# EAGLE design Center Dash (EAGLE 9.6.2)
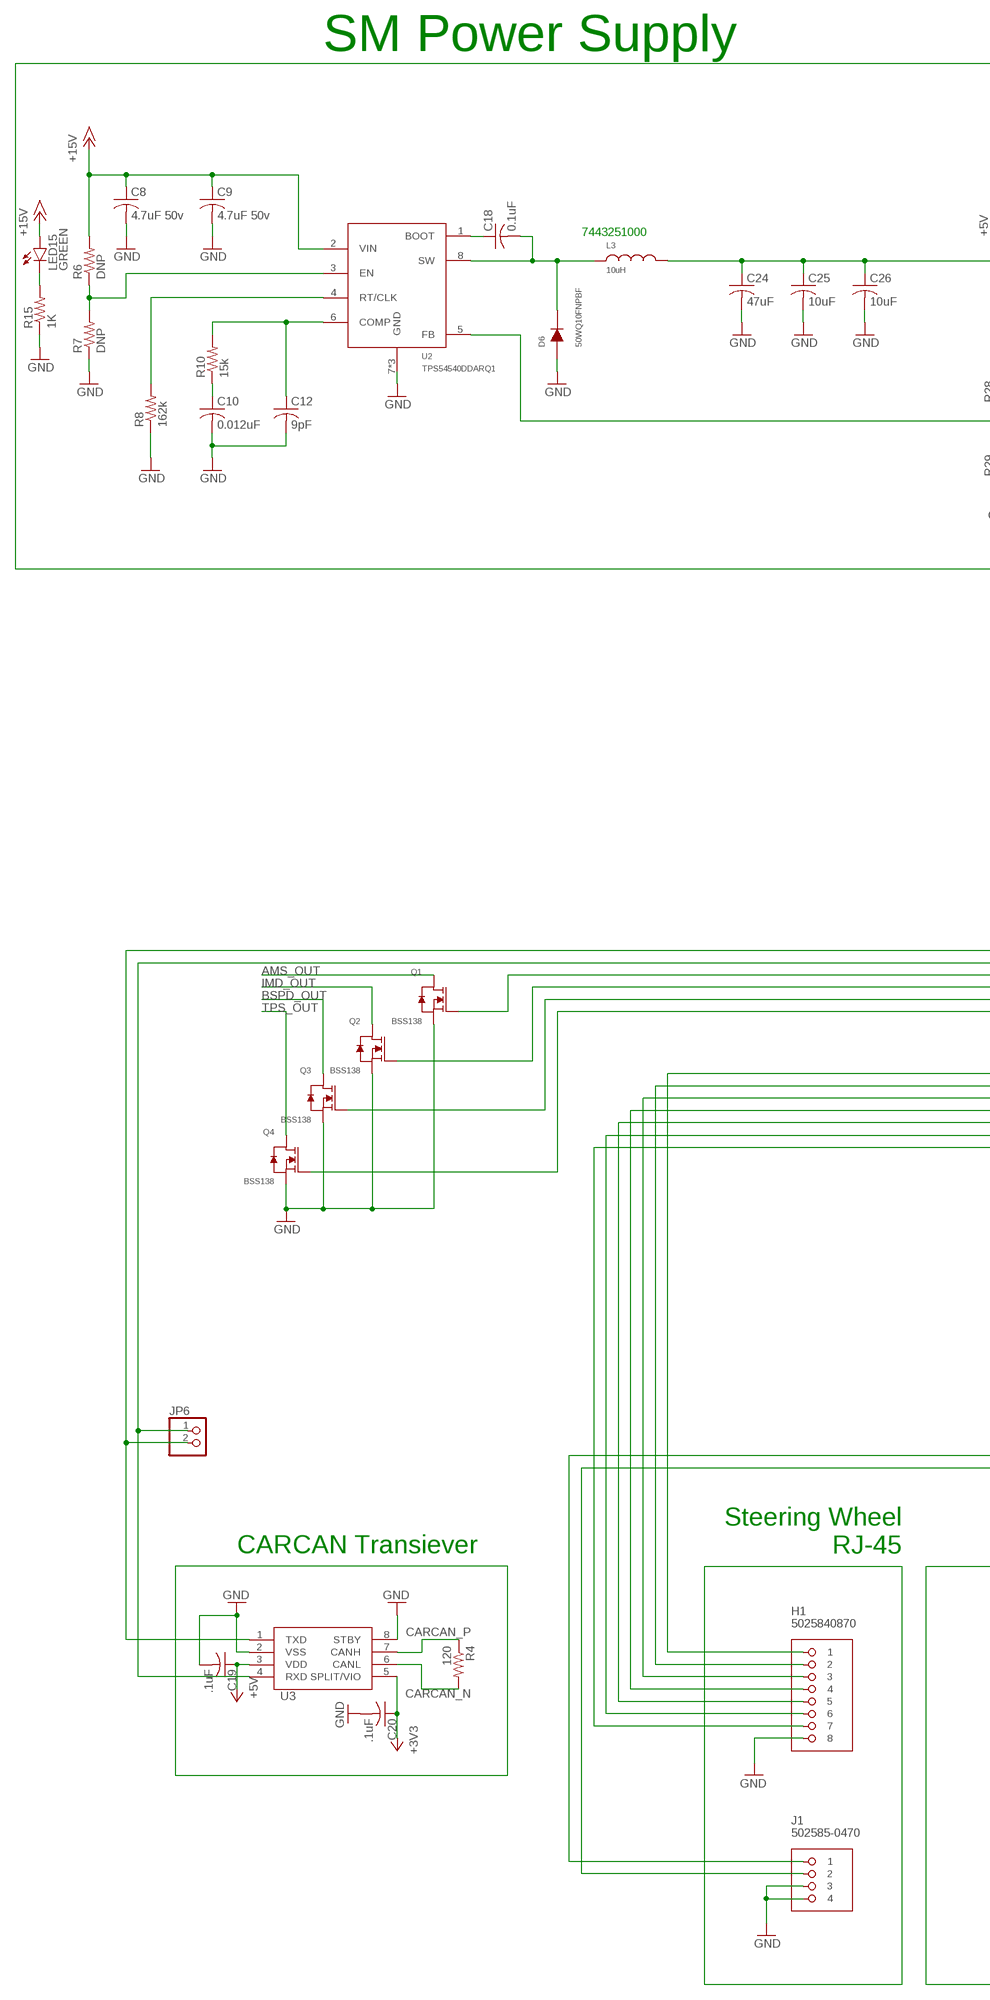
[diagram p0: schematic, sheet 1, part 1 of 2]
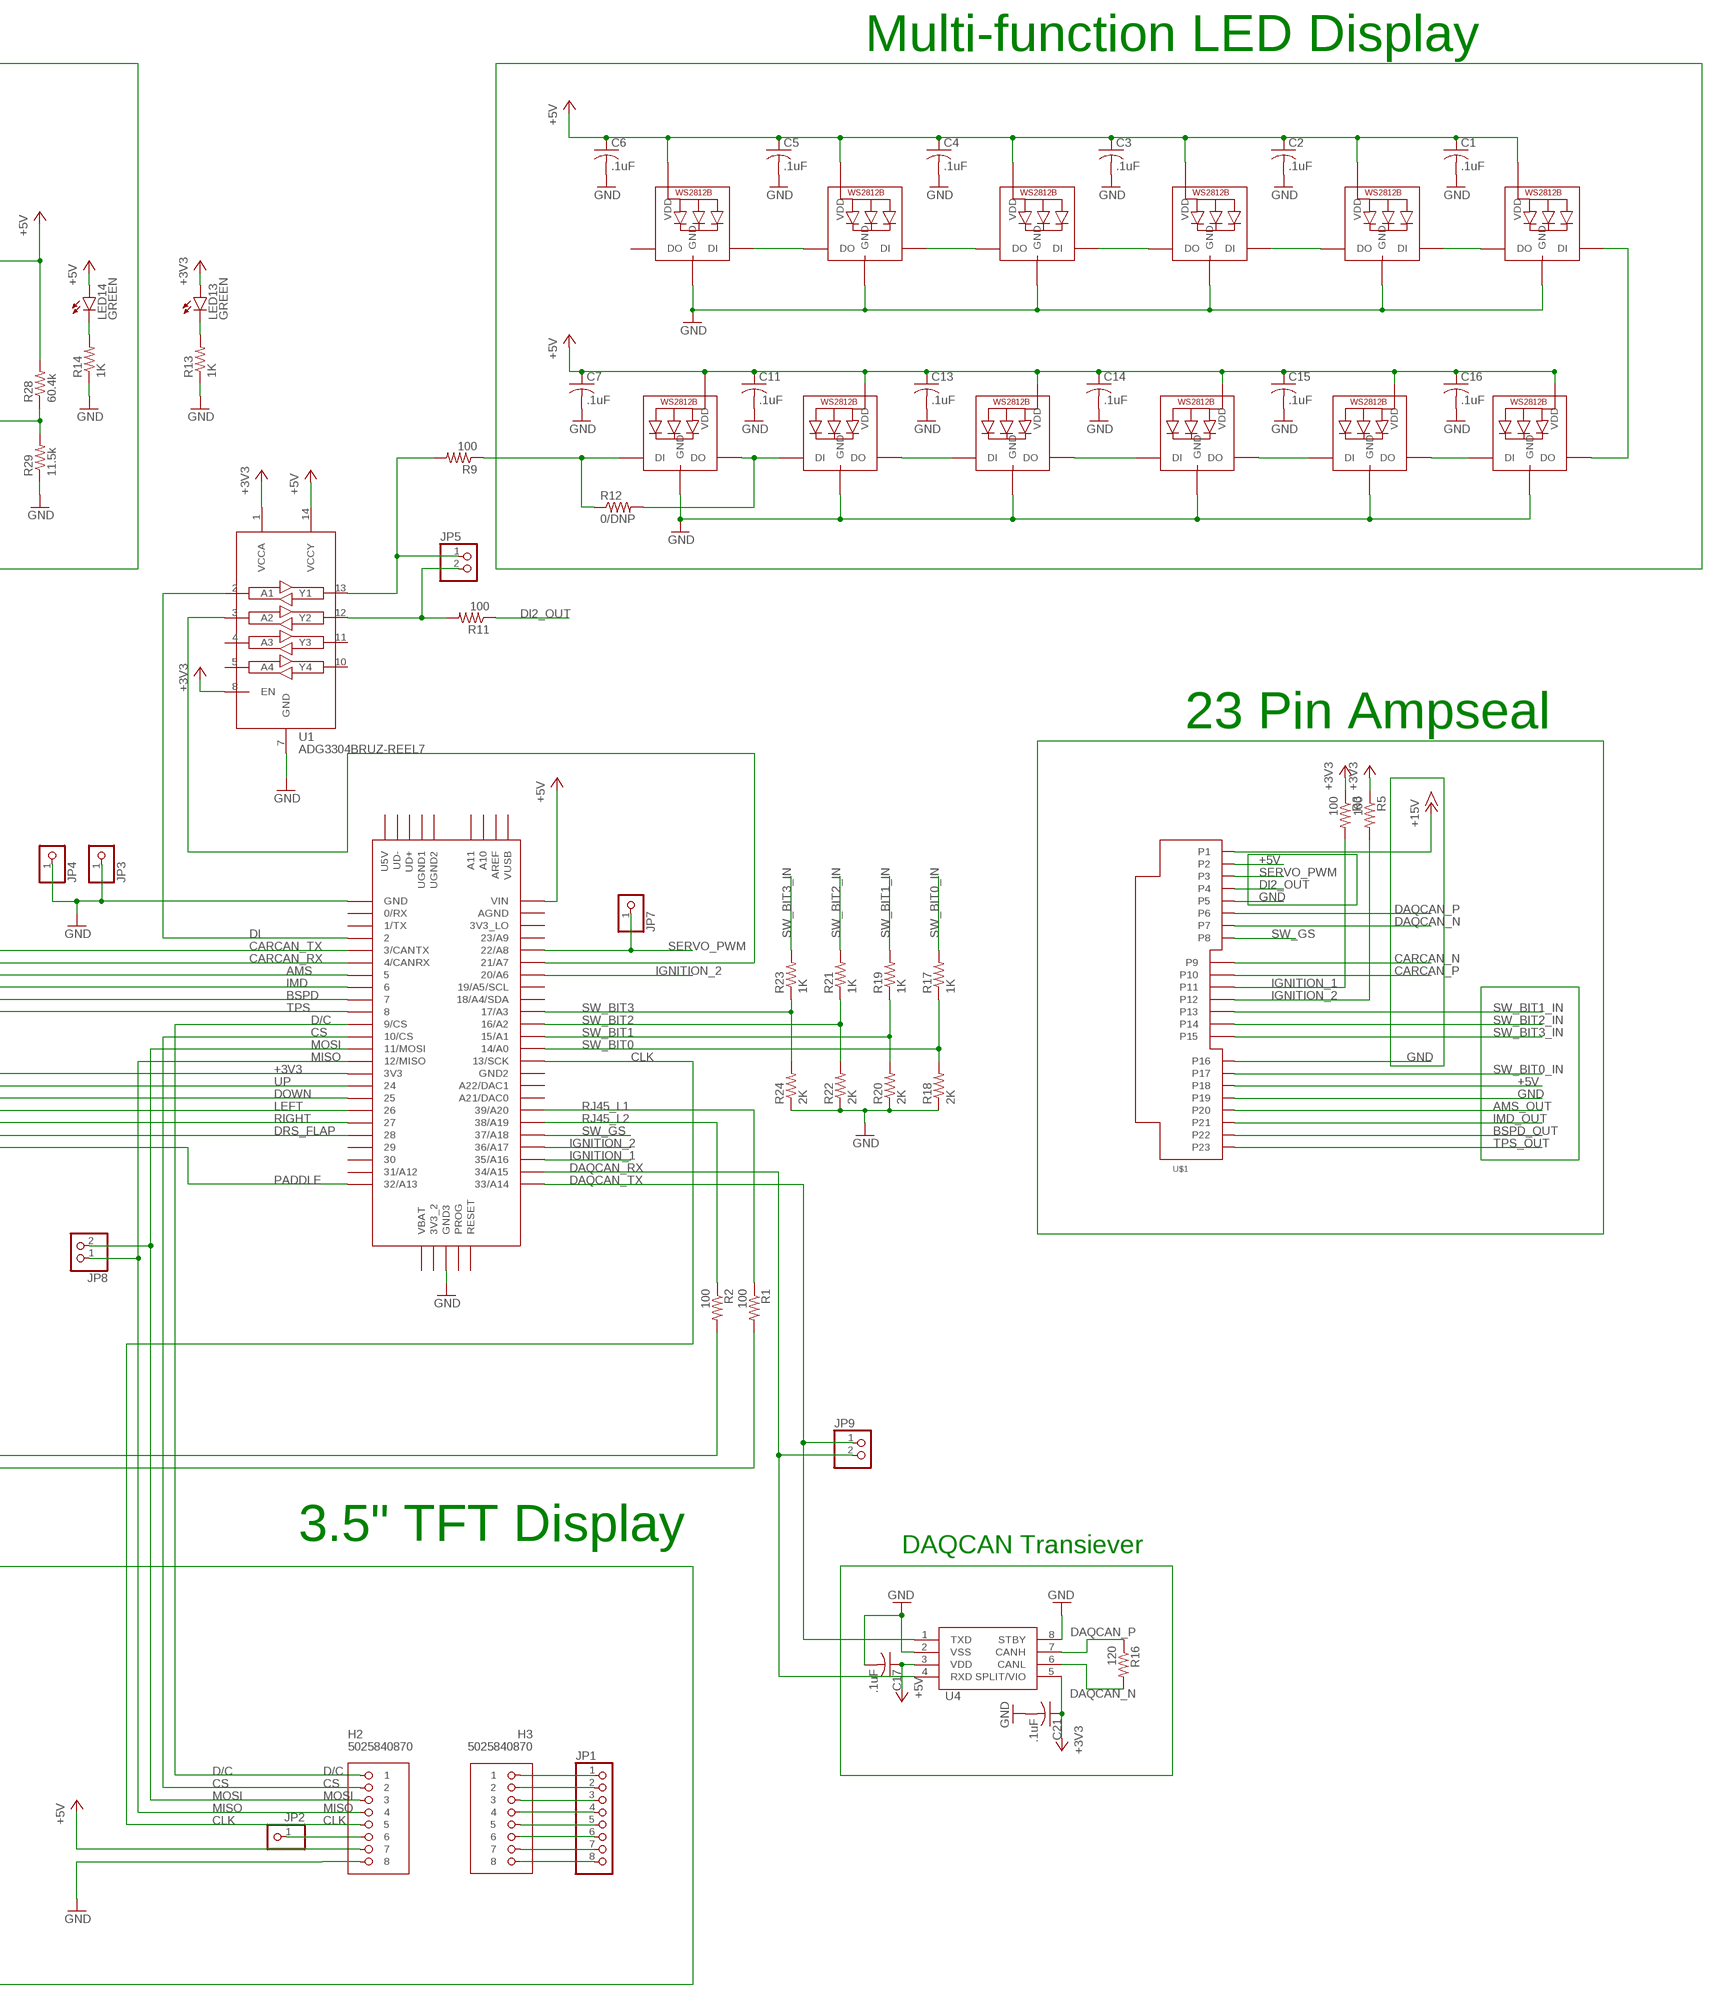
[diagram p1: schematic, sheet 1, part 2 of 2]

## Parts
C1  .1uF  C-USC0603K  [C0603K]
C2  .1uF  C-USC0603K  [C0603K]
C3  .1uF  C-USC0603K  [C0603K]
C4  .1uF  C-USC0603K  [C0603K]
C5  .1uF  C-USC0603K  [C0603K]
C6  .1uF  C-USC0603K  [C0603K]
C7  .1uF  C-USC0603K  [C0603K]
C8  4.7uF 50v  C-USC1206  [C1206]
C9  4.7uF 50v  C-USC1206  [C1206]
C10  0.012uF  C-USC0603K  [C0603K]
C11  .1uF  C-USC0603K  [C0603K]
C12  9pF  C-USC0603K  [C0603K]
C13  .1uF  C-USC0603K  [C0603K]
C14  .1uF  C-USC0603K  [C0603K]
C15  .1uF  C-USC0603K  [C0603K]
C16  .1uF  C-USC0603K  [C0603K]
C17  .1uF  C-USC0805  [C0805]
C18  0.1uF  C-USC0603K  [C0603K]
C19  .1uF  C-USC0805  [C0805]
C20  .1uF  C-USC0805  [C0805]
C21  .1uF  C-USC0805  [C0805]
C24  47uF  C-USC1206  [C1206]
C25  10uF  C-USC0603K  [C0603K]
C26  10uF  C-USC0603K  [C0603K]
D6  50WQ10FNPBF  VISHAY-50WQ10FNPBF  [DPAK]
H1  5025840870  MOLEX_CLICKMATE-8-VERTICAL  [MOLEX-CLIKMATE-8-VERTICAL-HEADER]
H2  5025840870  MOLEX_CLICKMATE-8-VERTICAL  [MOLEX-CLIKMATE-8-VERTICAL-HEADER]
H3  5025840870  MOLEX_CLICKMATE-8-VERTICAL  [MOLEX-CLIKMATE-8-VERTICAL-HEADER]
J1  502585-0470  MOLEX_CLICKMATE-4-R/A  [MOLEX-CLIKMATE-4-R/A]
JP1  PINHD-1X8  [1X08]
JP2  PINHD-1X1  [1X01]
JP3  PINHD-1X1  [1X01]
JP4  PINHD-1X1  [1X01]
JP5  PINHD-1X2  [1X02]
JP6  PINHD-1X2  [1X02]
JP7  PINHD-1X1  [1X01]
JP8  PINHD-1X2  [1X02]
JP9  PINHD-1X2  [1X02]
L3  10uH  WURTH-744325XXXX  [WURTH-744325XXXX]
LED1  WS2812B5050  [WS2812B]
LED2  WS2812B5050  [WS2812B]
LED3  WS2812B5050  [WS2812B]
LED4  WS2812B5050  [WS2812B]
LED5  WS2812B5050  [WS2812B]
LED6  WS2812B5050  [WS2812B]
LED7  WS2812B5050  [WS2812B]
LED8  WS2812B5050  [WS2812B]
LED9  WS2812B5050  [WS2812B]
LED10  WS2812B5050  [WS2812B]
LED11  WS2812B5050  [WS2812B]
LED12  WS2812B5050  [WS2812B]
LED13  GREEN  LEDCHIP-LED0805  [CHIP-LED0805]
LED14  GREEN  LEDCHIP-LED0805  [CHIP-LED0805]
LED15  GREEN  LEDCHIP-LED0805  [CHIP-LED0805]
Q1  BSS138  [BSS138]
Q2  BSS138  [BSS138]
Q3  BSS138  [BSS138]
Q4  BSS138  [BSS138]
R1  100  R-US_R0805  [R0805]
R2  100  R-US_R0805  [R0805]
R3  100  R-US_R0805  [R0805]
R4  120  R-US_R0805  [R0805]
R5  100  R-US_R0805  [R0805]
R6  DNP  R-US_R0603  [R0603]
R7  DNP  R-US_R0603  [R0603]
R8  162k  R-US_R0603  [R0603]
R9  100  R-US_R0805  [R0805]
R10  15k  R-US_R0603  [R0603]
R11  100  R-US_R0805  [R0805]
R12  0/DNP  R-US_R0805  [R0805]
R13  1K  R-US_R0805  [R0805]
R14  1K  R-US_R0805  [R0805]
R15  1K  R-US_R0805  [R0805]
R16  120  R-US_R0805  [R0805]
R17  1K  R-US_R0805  [R0805]
R18  2K  R-US_R0805  [R0805]
R19  1K  R-US_R0805  [R0805]
R20  2K  R-US_R0805  [R0805]
R21  1K  R-US_R0805  [R0805]
R22  2K  R-US_R0805  [R0805]
R23  1K  R-US_R0805  [R0805]
R24  2K  R-US_R0805  [R0805]
R28  60.4k  R-US_R0603  [R0603]
R29  11.5k  R-US_R0603  [R0603]
U1  ADG3304BRUZ-REEL7  ADG3304  [ADG3304]
U2  TPS54540DDARQ1  TPS54540  [TPS54540]
U3  MCP256X-SOIC  [SOIC8-N_MC]
U4  MCP256X-SOIC  [SOIC8-N_MC]
U$1  TE-776200-1  [TE-776200-1]
U$2  TEENSY_3.5/3.6  [TEENSY_3.5/3.6]

## Nets
5VREG_EN: R6.1 R7.2 U2.3(EN)
+3V3: C20.1 C21.1 H1.1 LED13.A R3.1 R5.1 U1.1(VCCA) U1.8(EN) U3.5(SPLIT/VIO) U4.5(SPLIT/VIO) U$2.3V3
+5V: C1.1 C2.1 C3.1 C4.1 C5.1 C6.1 C7.1 C11.1 C13.1 C14.1 C15.1 C16.1 C17.1 C19.1 C24.1 C25.1 C26.1 H2.7 L3.P$2 LED1.1-VDD(VDD) LED2.1-VDD(VDD) LED3.1-VDD(VDD) LED4.1-VDD(VDD) LED5.1-VDD(VDD) LED6.1-VDD(VDD) LED7.1-VDD(VDD) LED8.1-VDD(VDD) LED9.1-VDD(VDD) LED10.1-VDD(VDD) LED11.1-VDD(VDD) LED12.1-VDD(VDD) LED14.A R28.2 U1.14(VCCY) U3.3(VDD) U4.3(VDD) U$1.P$2(P2) U$1.P$18(P18) U$2.VIN
+15V: C8.1 C9.1 LED15.A R6.2 U2.2(VIN) U$1.P$1(P1)
AMS: Q1.G U$2.5
AMS_OUT: Q1.D U$1.P$20(P20)
BOOT_5V: C18.1 U2.1(BOOT)
BSPD: Q3.G U$2.7
BSPD_OUT: Q3.D U$1.P$22(P22)
CARCAN_N: R4.2 U3.6(CANL) U$1.P$9(P9)
CARCAN_P: R4.1 U3.7(CANH) U$1.P$10(P10)
CARCAN_RX: JP6.1 U3.4(RXD) U$2.4/CANRX
CARCAN_TX: JP6.2 U3.1(TXD) U$2.3/CANTX
CLK: H2.5 U$2.13/SCK
COMP_5V: C12.1 R10.2 U2.6(COMP)
CS: H2.2 U$2.10/CS
D/C: H2.1 U$2.9/CS
DAQCAN_N: R16.2 U4.6(CANL) U$1.P$7(P7)
DAQCAN_P: R16.1 U4.7(CANH) U$1.P$6(P6)
DAQCAN_RX: JP9.2 U4.4(RXD) U$2.34/A15
DAQCAN_TX: JP9.1 U4.1(TXD) U$2.33/A14
DI: U1.2(A1) U$2.2
DI2_MORE: JP5.2 R11.2 U1.12(Y2)
DI2_OUT: R11.1 U$1.P$4(P4)
DI_MORE: U1.3(A2) U$2.21/A7
DOWN: H1.3 U$2.25
DRS_FLAP: H1.6 U$2.28
FB_5V: R28.1 R29.2 U2.5(FB)
GND: C1.2 C2.2 C3.2 C4.2 C5.2 C6.2 C7.2 C8.2 C9.2 C10.2 C11.2 C12.2 C13.2 C14.2 C15.2 C16.2 C17.2 C19.2 C20.2 C21.2 C24.2 C25.2 C26.2 D6.1(ANODE) D6.3(ANODE) H1.8 H2.8 J1.3 J1.4 JP3.1 JP4.1 LED1.3-GND(GND) LED2.3-GND(GND) LED3.3-GND(GND) LED4.3-GND(GND) LED5.3-GND(GND) LED6.3-GND(GND) LED7.3-GND(GND) LED8.3-GND(GND) LED9.3-GND(GND) LED10.3-GND(GND) LED11.3-GND(GND) LED12.3-GND(GND) Q1.S Q2.S Q3.S Q4.S R7.1 R8.1 R13.1 R14.1 R15.1 R18.1 R20.1 R22.1 R24.1 R29.1 U1.7(GND) U2.7(GND) U2.PAD1(GND) U2.PAD(GND) U3.2(VSS) U3.8(STBY) U4.2(VSS) U4.8(STBY) U$1.P$5(P5) U$1.P$16(P16) U$1.P$19(P19) U$2.GND U$2.GND3
IGNITION_1: R3.2 U$1.P$11(P11) U$2.35/A16
IGNITION_2: R5.2 U$1.P$12(P12) U$2.20/A6 U$2.36/A17
IMD: Q2.G U$2.6
IMD_OUT: Q2.D U$1.P$21(P21)
LEFT: H1.4 U$2.26
MISO: H2.4 JP8.1 U$2.12/MISO
MOSI: H2.3 JP8.2 U$2.11/MOSI
N$2: LED1.2-DOUT(DO) LED2.4-DIN(DI) R12.2
N$3: H3.1 JP1.1
N$4: LED2.2-DOUT(DO) LED3.4-DIN(DI)
N$5: LED3.2-DOUT(DO) LED4.4-DIN(DI)
N$6: LED4.2-DOUT(DO) LED5.4-DIN(DI)
N$7: LED5.2-DOUT(DO) LED6.4-DIN(DI)
N$8: LED6.2-DOUT(DO) LED7.4-DIN(DI)
N$11: LED1.4-DIN(DI) R9.1 R12.1
N$13: H3.2 JP1.2
N$15: H3.3 JP1.3
N$16: H3.4 JP1.4
N$17: H3.5 JP1.5
N$18: H3.6 JP1.6
N$19: H3.7 JP1.7
N$20: LED14.C R14.2
N$21: JP5.1 R9.2 U1.13(Y1)
N$22: LED15.C R15.2
N$26: H3.8 JP1.8
N$27: H2.6 JP2.1
N$29: C10.1 R10.1
N$34: J1.1 R2.2
N$35: J1.2 R1.2
N$36: LED7.2-DOUT(DO) LED8.4-DIN(DI)
N$37: LED8.2-DOUT(DO) LED9.4-DIN(DI)
N$38: LED9.2-DOUT(DO) LED10.4-DIN(DI)
N$39: LED10.2-DOUT(DO) LED11.4-DIN(DI)
N$40: LED11.2-DOUT(DO) LED12.4-DIN(DI)
N$56: LED13.C R13.2
PADDLE: H1.7 U$2.32/A13
RIGHT: H1.5 U$2.27
RJ45_L1: R1.1 U$2.39/A20
RJ45_L2: R2.1 U$2.38/A19
RT_5V: R8.2 U2.4(RT/CLK)
SERVO_PWM: JP7.1 U$1.P$3(P3) U$2.22/A8
SW_5V: C18.2 D6.2(CATHODE) L3.P$1 U2.8(SW)
SW_BIT0: R17.1 R18.2 U$2.14/A0
SW_BIT0_IN: R17.2 U$1.P$17(P17)
SW_BIT1: R19.1 R20.2 U$2.15/A1
SW_BIT1_IN: R19.2 U$1.P$13(P13)
SW_BIT2: R21.1 R22.2 U$2.16/A2
SW_BIT2_IN: R21.2 U$1.P$14(P14)
SW_BIT3: R23.1 R24.2 U$2.17/A3
SW_BIT3_IN: R23.2 U$1.P$15(P15)
SW_GS: U$1.P$8(P8) U$2.37/A18
TPS: Q4.G U$2.8
TPS_OUT: Q4.D U$1.P$23(P23)
UP: H1.2 U$2.24
Unconnected: LED12.2-DOUT(DO) U1.4(A3) U1.5(A4) U1.10(Y4) U1.11(Y3) U$2.0/RX U$2.1/TX U$2.3V3_2 U$2.3V3_LO U$2.18/A4/SDA U$2.19/A5/SCL U$2.21/DAC0(A21/DAC0) U$2.23/A9 U$2.29 U$2.30 U$2.31/A12 U$2.A10 U$2.A11 U$2.A22/DAC1 U$2.AGND U$2.AREF U$2.GND2 U$2.PROG U$2.RESET U$2.U5V U$2.UD+ U$2.UD- U$2.UGND1 U$2.UGND2 U$2.VBAT U$2.VUSB

## Notes on the sheet
- SM Power Supply | Multi-function LED Display
- 7443251000
- 23 Pin Ampseal
- 3.5" TFT Display
- CARCAN Transiever
- Steering Wheel
          RJ-45
- DAQCAN Transiever

## Library data of the parts
C1-C7 C11 C13-C16 C25 C26 = rcl:C-US: CAPACITOR, American symbol; PARTNO: GRM188R61A106KE69D
C8 C9 = rcl:C-US: CAPACITOR, American symbol; PARTNO: GRM31CR71H475KA12L
C10 = rcl:C-US: CAPACITOR, American symbol; PARTNO: GRM188R71H123KA01D
C12 = rcl:C-US: CAPACITOR, American symbol; PARTNO: GRM1885C1H9R0DA01D
C17 C19-C21 = rcl:C-US: CAPACITOR, American symbol
C18 = rcl:C-US: CAPACITOR, American symbol; PARTNO: GRM188R71E104KA01D
C24 = rcl:C-US: CAPACITOR, American symbol; PARTNO: GRM31CR61A476ME15L
D6 = FormE:VISHAY-50WQ10FNPBF; PARTNO: VS-50WQ10FNPBF
H1-H3 = FormE:MOLEX_CLICKMATE-8-VERTICAL: 505405-0860
J1 = FormE:MOLEX_CLICKMATE-4-R/A
JP1 = pinhead:PINHD-1X8: PIN HEADER
JP2-JP4 JP7 = pinhead:PINHD-1X1: PIN HEADER
JP5 JP6 JP8 JP9 = pinhead:PINHD-1X2: PIN HEADER
L3 = FormE:WURTH-744325XXXX; PARTNO: 7443251000
LED1-LED12 = adafruit:WS2812B
LED13-LED15 = FormE:LED: LED OSRAM: - CHIPLED LG R971, LG N971, LY N971, LG Q971, LY Q971, LO R971, LY R971 LH N974, LH R974 LS Q976, LO Q976, LY Q976 LO Q996 - Hyper CHIPLED LW Q18S LB Q993, LB Q99A, LB R99A - SideLED LS A670, LO A670, LY A670, LG A670, LP A670 LB A673, LV A673, LT A673, LW A673 LH A674 LY A675 LS A676, LA A676, LO A676, LY A676, LW A676 LS A679, LY A679, LG A679 - Hyper Micro SIDELED® LS Y876, LA Y876, LO Y876, LY Y876 LT Y87S - SmartLED LW L88C, LW L88S LB L89C, LB L89S, LG L890 LS L89K, LO L89K, LY L89K LS L896, LA L896, LO L896, LY L896 - TOPLED LS T670, LO T670, LY T670, LG T670, LP T670 LSG T670, LSP T670, LSY T670, LOP T670, LYG T670 LG T671, LOG T671, LSG T671 LB T673, LV T673, LT T673, LW T673 LH T674 LS T676, LA T676, LO T676, LY T676, LB T676, LH T676, LSB T676, LW T676 LB T67C, LV T67C, LT T67C, LS T67K, LO T67K, LY T67K, LW E67C LS E67B, LA E67B, LO E67B, LY E67B, LB E67C, LV E67C, LT E67C LW T67C LS T679, LY T679, LG T679 LS T770, LO T770, LY T770, LG T770, LP T770 LB T773, LV T773, LT T773, LW T773 LH T774 LS E675, LA E675, LY E675, LS T675 LS T776, LA T776, LO T776, LY T776, LB T776 LHGB T686 LT T68C, LB T68C - Hyper Mini TOPLED® LB M676 - Mini TOPLED Santana® LG M470 LS M47K, LO M47K, LY M47K Source: http://www.osram.convergy.de/; PARTNO: 598-8170-107F
Q1-Q4 = FormE:BSS138
R1-R5 R9 R11 R12 R16 = rcl:R-US_: RESISTOR, American symbol
R6 R7 = rcl:R-US_: RESISTOR, American symbol; PARTNO: *
R8 = rcl:R-US_: RESISTOR, American symbol; PARTNO: ERJ-3EKF1623V
R10 = rcl:R-US_: RESISTOR, American symbol; PARTNO: ERJ-3EKF1502V
R13-R15 R17-R24 = adafruit:R-US_: RESISTOR, American symbol; PARTNO: ERJ-6ENF1001V
R28 = rcl:R-US_: RESISTOR, American symbol; PARTNO: ERJ-3EKF6042V
R29 = rcl:R-US_: RESISTOR, American symbol; PARTNO: ERJ-3EKF1152V
U1 = FormE:ADG3304
U2 = FormE:TPS54540; PARTNO: TPS54540DDAR
U3 U4 = FormE:MCP256X: MCP2561/2 CAN Transceiver Microchip High-Speed CAN Transceiver Datasheet <http://ww1.microchip.com/downloads/en/DeviceDoc/20005167C.pdf>
U$1 = FormE:TE-776200-1: 23-Pin Amp Seal 180
U$2 = Teensy356:TEENSY_3.5/3.6

## Board
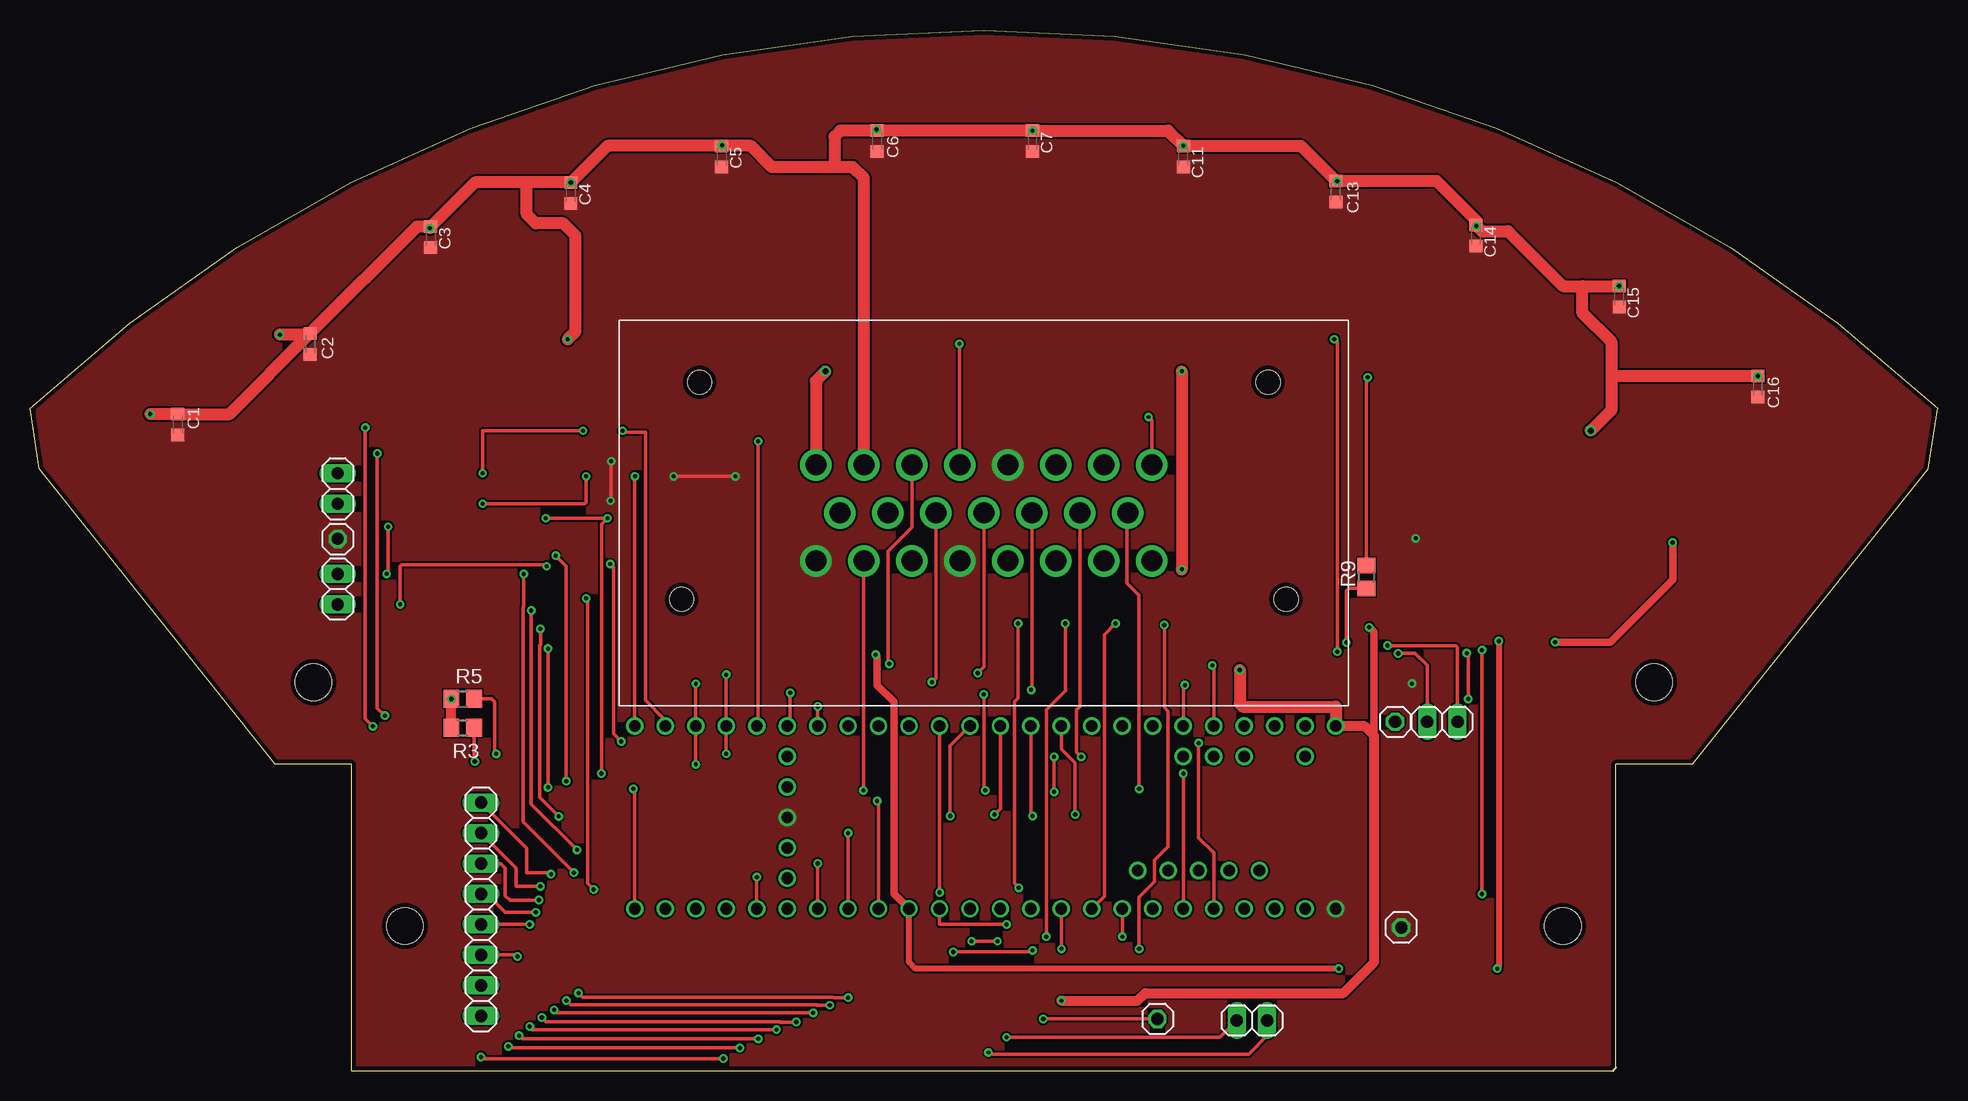
[diagram p2: board, top side]
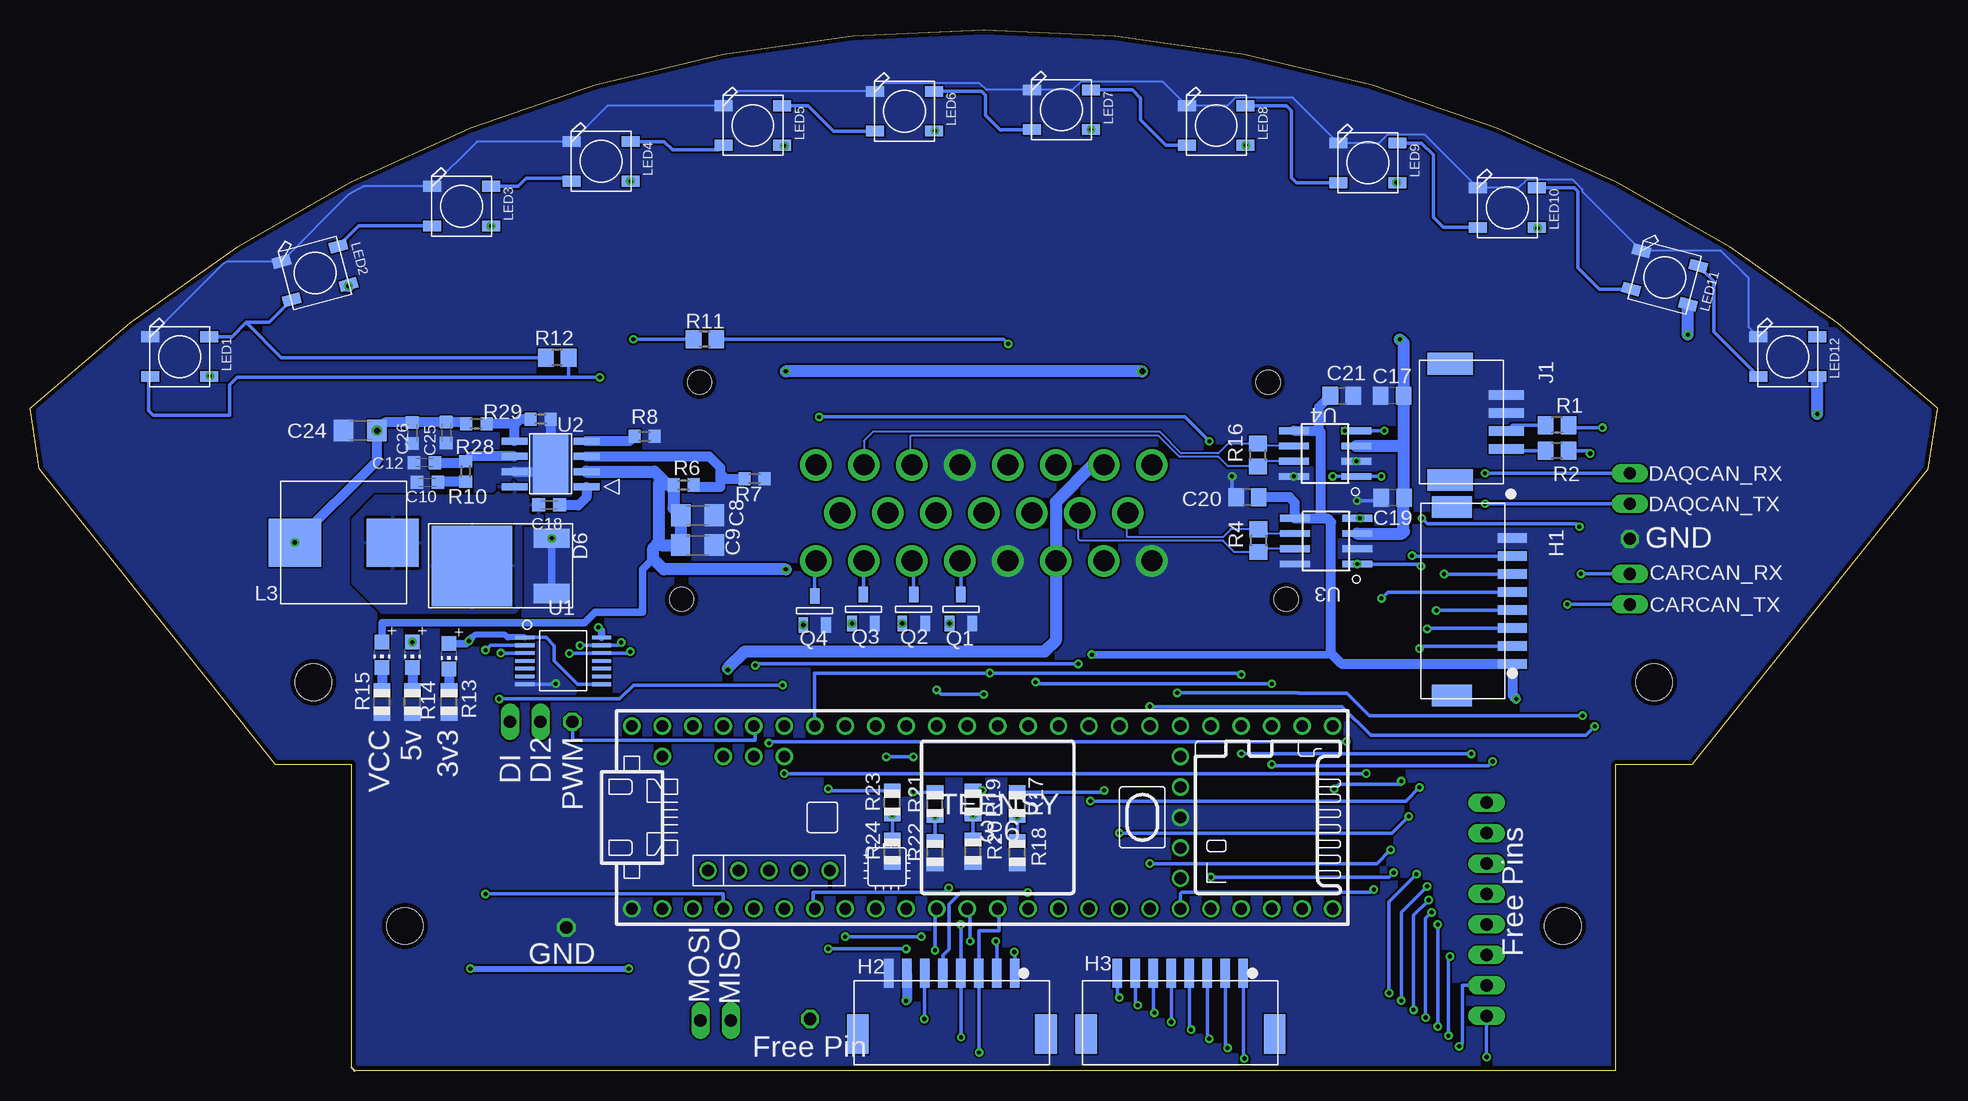
[diagram p3: board, bottom side, seen from below]

Size 159 x 86.73 mm. Coordinates in mm from the lower left corner, seen from the top.
Outline: 26.8,0 26.8,25.53 20.45,25.53 0.76,50.16 0,55.19 arc-87 159,55.19 158.24,50.16 138.56,25.53 132.21,25.53 132.21,0.25 131.95,0 26.8,0
Copper layers (1*16): Top 0.0356mm / dielectric 1.5011mm / Bottom 0.0356mm
Design rules "OSH_PCB Rules": minimum track width 6mil, minimum drill 13mil, track to track 6mil, track to pad 6mil, pad to pad 6mil, via to via 6mil, smd to smd 6mil, copper to edge 15mil, drill to drill 6mil, minimum pad ring 7mil, minimum via ring 7mil, stop-mask expansion 3mil, vias tented up to drill 0mil, thermal gap 10mil
Holes 3.05 mm at 127.76,12.07 31.24,12.07 23.62,32.39 135.38,32.39

### Footprints (pad centres in the part's own frame; a part is rotated, then mirrored left to right if it is on the bottom)
C0603K = smd 1.05 x 1.08: 1 -0.875,0; 2 0.875,0
C1206 = smd 1.6 x 1.8: 1 -1.4,0; 2 1.4,0
C0805 = smd 1.3 x 1.5: 1 -0.95,0; 2 0.95,0
DPAK = smd 3 x 1.6: 1 4.25,-2.3; 3 4.25,2.3 | smd 6.7 x 6.7: 2 -2.4,0
MOLEX-CLIKMATE-8-VERTICAL-HEADER = smd 0.8 x 2.4: 1 5.25,4.064; 2 3.75,4.064; 3 2.25,4.064; 4 0.75,4.064; 5 -0.75,4.064; 6 -2.25,4.064; 7 -3.75,4.064; 8 -5.25,4.064 | smd 1.8 x 3.3: M1 7.85,-0.986; M2 -7.85,-0.986
MOLEX-CLIKMATE-4-R/A = smd 0.8 x 2.9: 1 2.25,3.7; 2 0.75,3.7; 3 -0.75,3.7; 4 -2.25,3.7 | smd 1.8 x 3.8: M1 4.85,-1; M2 -4.85,-1
1X08 = drill 1.016 long: 1 -8.89,0; 2 -6.35,0; 3 -3.81,0; 4 -1.27,0; 5 1.27,0; 6 3.81,0; 7 6.35,0; 8 8.89,0
1X01 = drill 1.016 octagon: 1 0,0
1X02 = drill 1.016 long: 1 -1.27,0; 2 1.27,0
WURTH-744325XXXX = smd 4.35 x 4: P$1 -4.075,0; P$2 4.075,0
WS2812B = smd 1.5 x 0.9: 1-VDD 2.45,-1.65; 2-DOUT 2.45,1.65; 3-GND -2.45,1.65; 4-DIN -2.45,-1.65
CHIP-LED0805 = smd 1.2 x 1.2: A 0,-1.05; C 0,1.05
BSS138 = smd 0.8 x 1.3: D 0,1.2; G -0.95,-1.2; S 0.95,-1.2
R0805 = smd 1.3 x 1.5: 1 -0.95,0; 2 0.95,0
R0603 = smd 1 x 1.1: 1 -0.85,0; 2 0.85,0
R0805' = smd 1.1 x 1.4: 1 -1,0; 2 1,0
ADG3304 = smd 0.3 x 1.6: 1 -1.95,-3.2; 2 -1.3,-3.2; 3 -0.65,-3.2; 4 0,-3.2; 5 0.65,-3.2; 6 1.3,-3.2; 7 1.95,-3.2; 8 1.95,3.2; 9 1.3,3.2; 10 0.65,3.2; 11 0,3.2; 12 -0.65,3.2; 13 -1.3,3.2; 14 -1.95,3.2
TPS54540 = smd 0.6 x 2.15: 1 -1.905,-3; 2 -0.635,-3; 3 0.635,-3; 4 1.905,-3; 5 1.905,3; 6 0.635,3; 7 -0.635,3; 8 -1.905,3 | smd 3.1 x 2.4: PAD 0,0 | smd 4.9 x 2.95: PAD1 0,0
SOIC8-N_MC = smd 2.5 x 0.559: 1 -2.6,1.905; 2 -2.6,0.635; 3 -2.6,-0.635; 4 -2.6,-1.905; 5 2.6,-1.905; 6 2.6,-0.635; 7 2.6,0.635; 8 2.6,1.905
TE-776200-1 = drill 1.75: P$1 -14,4; P$2 -10,4; P$3 -6,4; P$4 -2,4; P$5 2,4; P$6 6,4; P$7 10,4; P$8 14,4; P$9 -12,0; P$10 -8,0; P$11 -4,0; P$12 0,0; P$13 4,0; P$14 8,0; P$15 12,0; P$16 -14,-4; P$17 -10,-4; P$18 -6,-4; P$19 -2,-4; P$20 2,-4; P$21 6,-4; P$22 10,-4; P$23 14,-4 | hole 2: -23.7,10.9; 23.7,10.9; 25.2,-7.2; -25.2,-7.2
TEENSY_3.5/3.6 = drill 0.965: 0/RX -25.4,-7.62; 1/TX -22.86,-7.62; 2 -20.32,-7.62; 3/CANTX -17.78,-7.62; 3V3 7.62,-7.62; 3V3_2 17.78,-2.54; 3V3_LO -22.86,7.62; 4/CANRX -15.24,-7.62; 5 -12.7,-7.62; 6 -10.16,-7.62; 7 -7.62,-7.62; 8 -5.08,-7.62; 9/CS -2.54,-7.62; 10/CS 0,-7.62; 11/MOSI 2.54,-7.62; 12/MISO 5.08,-7.62; 13/SCK 5.08,7.62; 14/A0 2.54,7.62; 15/A1 0,7.62; 16/A2 -2.54,7.62; 17/A3 -5.08,7.62; 18/A4/SDA -7.62,7.62; 19/A5/SCL -10.16,7.62; 20/A6 -12.7,7.62; 21/A7 -15.24,7.62; 21/DAC0 12.7,7.62; 22/A8 -17.78,7.62; 23/A9 -20.32,7.62; 24 10.16,-7.62; 25 12.7,-7.62; 26 15.24,-7.62; 27 17.78,-7.62; 28 20.32,-7.62; 29 22.86,-7.62; 30 25.4,-7.62; 31/A12 27.94,-7.62; 32/A13 30.48,-7.62; 33/A14 30.48,7.62; 34/A15 27.94,7.62; 35/A16 25.4,7.62; 36/A17 22.86,7.62; 37/A18 20.32,7.62; 38/A19 17.78,7.62; 39/A20 15.24,7.62; A10 -17.78,5.08; A11 -15.24,5.08; A22/DAC1 10.16,7.62; AGND -25.4,7.62; AREF -20.32,5.08; GND -27.94,-7.62; GND2 7.62,7.62; GND3 17.78,0; PROG 17.78,2.54; RESET 17.78,5.08; U5V -21.59,-4.445; UD+ -16.51,-4.445; UD- -19.05,-4.445; UGND1 -13.97,-4.445; UGND2 -11.43,-4.445; VBAT 17.78,-5.08; VIN -27.94,7.62; VUSB -25.4,5.08

### Placement (x,y rotation side)
C1  12.32,53.85 270 top
C2  23.37,60.58 270 top
C3  33.4,69.47 270 top
C4  45.08,73.15 270 top
C5  57.66,76.2 270 top
C6  70.61,77.47 270 top
C7  83.57,77.47 270 top
C8  103.36,46.29 0 bottom
C9  103.37,43.8 0 bottom
C10  125.88,49.03 180 bottom
C11  96.14,76.2 270 top
C12  126.13,50.68 180 bottom
C13  108.84,73.28 270 top
C14  120.52,69.6 270 top
C15  132.46,64.52 270 top
C16  144.02,57.02 270 top
C17  45.47,56.26 180 bottom
C18  115.74,47.15 180 bottom
C19  45.42,47.75 180 bottom
C20  57.53,47.8 180 bottom
C21  49.66,56.26 0 bottom
C24  131.48,53.35 180 bottom
C25  124.31,53.17 270 bottom
C26  127.13,53.16 270 bottom
D6  119.76,42.07 0 bottom
H1  39.5,39.14 270 bottom
H2  82.17,4.06 0 bottom
H3  63.12,4.06 0 bottom
J1  39.63,54.07 270 bottom
JP1  37.59,13.46 90 top
JP2  93.98,4.32 0 top
JP3  114.3,11.94 270 top
JP4  25.65,44.32 90 top
JP5  117.73,29.08 180 top
JP6  25.65,40.13 270 top
JP7  113.79,29.08 0 top
JP8  101.85,4.19 0 top
JP9  25.65,48.51 90 top
L3  132.85,44.02 180 bottom
LED1  146.52,59.51 0 bottom
LED2  135.24,66.48 15 bottom
LED3  123.02,72.05 0 bottom
LED4  111.4,75.79 0 bottom
LED5  98.75,78.77 0 bottom
LED6  86.11,79.96 0 bottom
LED7  73.02,80.08 0 bottom
LED8  60.13,78.77 0 bottom
LED9  47.47,75.66 0 bottom
LED10  35.85,71.93 0 bottom
LED11  22.74,66.1 345 bottom
LED12  12.49,59.51 0 bottom
LED13  124.08,34.54 180 bottom
LED14  127.13,34.67 180 bottom
LED15  129.67,34.67 180 bottom
Q1  81.41,38.48 0 bottom
Q2  85.34,38.48 0 bottom
Q3  89.53,38.48 0 bottom
Q4  93.6,38.35 0 bottom
R1  31.71,53.81 180 bottom
R2  31.71,51.66 180 bottom
R3  36.07,28.57 0 top
R4  56.59,44.18 90 bottom
R5  36.07,30.99 0 top
R6  104.52,48.81 180 bottom
R7  98.61,49.35 180 bottom
R8  107.77,52.87 180 bottom
R9  111.38,41.15 270 top
R10  122.69,49.95 90 bottom
R11  102.74,60.96 180 bottom
R12  115.06,59.44 180 bottom
R13  1K  [R0805']  124.08,30.73 90 bottom
R14  1K  [R0805']  127.13,30.73 90 bottom
R15  1K  [R0805']  129.67,30.73 90 bottom
R16  56.64,51.31 90 bottom
R17  1K  [R0805']  76.71,22.22 90 bottom
R18  2K  [R0805']  76.71,18.16 90 bottom
R19  1K  [R0805']  80.39,22.35 90 bottom
R20  2K  [R0805']  80.39,18.29 90 bottom
R21  1K  [R0805']  83.57,22.22 90 bottom
R22  2K  [R0805']  83.57,18.16 90 bottom
R23  1K  [R0805']  87.12,22.35 90 bottom
R24  2K  [R0805']  87.12,18.29 90 bottom
R28  121.81,53.92 180 bottom
R29  116.44,54.3 180 bottom
U1  114.55,34.16 270 bottom
U2  115.61,50.57 90 bottom
U3  50.97,44.14 180 bottom
U4  51.05,51.44 180 bottom
U$1  79.5,46.48 0 top
U$2  80.89,21.12 0 bottom

### Tracks (layer width: path | path; a pad name or v marks a point on that pad's centre or on a via)
5VREG_EN
  Bottom 0.813: U2.3 102.38,51.2 101.47,50.29 101.47,49.78 | 101.47,49.78 101.47,48.64 103.5,48.64 R6.1 | 101.47,49.78 101.04,49.35 R7.2
+3V3  (via drill 0.35)
  Top 0.508: v109.09,8.51 73.79,8.51 73.27,9.03 U$2.3V3 | v122.43,35.81 122.43,8.64 v122.3,8.51
  Top 0.61: v70.48,34.67 70.61,34.54 70.61,32.13 72.01,30.73 72.01,14.76 U$2.3V3
  Top 0.813: R3.1 R5.1
  Bottom 0.305: U1.1 116,36.11 115.32,35.43 115.32,34.16 113.37,32.21 U1.8
  Bottom 0.508: U1.1 119.17,36.11 119.38,36.32 121.92,36.32 122.17,36.07 v122.43,35.81 | v122.3,8.51 v109.09,8.51
  Bottom 0.61: 50.55,34.8 50.67,34.67 v70.48,34.67 | LED13.A 122.65,35.59 122.17,36.07
  Bottom 0.813: R5.1 35.43,31.3 H1.1 49.64,33.89 50.55,34.8 50.55,45.72 50.87,46.04 51.43,46.04 | 51.43,46.04 U3.5 53.57,47.35 54.02,47.8 C20.1 | U4.5 51.56,53.34 | 51.56,53.34 51.43,53.21 51.43,46.04 | 51.56,53.34 51.56,55.31 C21.1
  other vias: 35.12,30.99
+5V  (via drill 0.33, 0.35, 0.5)
  Top 0.61: 112.01,27.94 112.01,36.58 v111.63,36.96 | LED14.A 131.73,35.72 136.92,40.91 L3.P$2
  Top 0.813: 12.3,54.72 C1.1 | C5.1 57.68,77.09 LED8.1-VDD | C6.1 70.57,78.39 LED7.1-VDD | C13.1 108.85,74.14 LED4.1-VDD | 120.52,70.87 C14.1 120.57,70.42 LED3.1-VDD | v85.98,5.84 92.33,5.84 92.96,6.48 109.47,6.48 112.01,9.02 112.01,27.94 111.21,28.74 U$2.VIN | 100.84,30.61 101.09,30.35
  Top 1.016: C24.1 131.83,55.1 131.83,57.78 | v100.84,33.4 100.84,30.61 | 101.09,30.35 108.84,30.35 U$2.VIN | U$1.P$2 69.5,74.39 68.58,75.31 67.06,75.31 | v44.83,60.96 45.47,61.59 45.47,69.6 44.45,70.61 42.16,70.61 41.4,71.37 41.4,74.03 | 67.06,75.31 61.85,75.31 60.08,77.07 C5.1 48.13,77.07 C4.1 41.4,74.03 | 67.06,75.31 67.06,77.85 67.55,78.34 C6.1 C7.1 94.87,78.34 C11.1 105.92,77.07 C13.1 117.23,74.15 120.52,70.87 | 41.4,74.03 37.08,74.03 C3.1 | C3.1 33.34,70.28 v33.34,70.21 | C14.1 121.02,69.98 123.19,69.98 127.78,65.39 129.41,65.39 | 129.41,65.39 C15.1 | 131.83,57.78 131.83,60.7 129.41,63.12 129.41,65.39 | C16.1 131.95,57.9 131.83,57.78 | C3.1 32.26,70.34 C2.1 | v10.03,54.74 10.05,54.72 C1.1 16.64,54.72 C2.1 | C2.1 23.25,61.34 v20.83,61.34
  Bottom 0.152: 20.83,63.85 LED11.1-VDD
  Bottom 0.305: LED1.1-VDD 144.05,57.88 144.05,57.92 | 120.6,70.4 LED3.1-VDD | LED4.1-VDD 108.95,74.1 108.91,74.05 | 96.34,77.11 96.32,77.12 LED5.1-VDD | LED6.1-VDD 83.65,78.32 83.54,78.32 | 70.57,78.38 LED7.1-VDD | LED8.1-VDD 57.69,77.14 57.7,77.14 | LED9.1-VDD 44.99,74.06 | LED10.1-VDD 33.4,70.21 v33.34,70.21 33.22,70.33 33.22,70.34 | LED12.1-VDD 10.03,57.9
  Bottom 0.61: v111.63,36.96 111.35,36.68 U1.14
  Bottom 0.813: R28.2 122.79,54.05 C25.1 124.32,54.03 C26.1 129.4,54.03 C24.1 130.08,50.85 L3.P$2 | 83.54,78.32 | 108.97,74.12 LED4.1-VDD | LED9.1-VDD 45.07,74.01 C4.1 | LED1.1-VDD 144.05,57.86 C16.1 | LED5.1-VDD 96.25,77.07 C11.1 | LED6.1-VDD 83.6,78.31 C7.1 | H2.7 85.92,5.9 v85.98,5.84 | 100.84,33.53 v100.84,33.4
  Bottom 1.016: 100.84,33.53 99.44,34.92 74.42,34.92 73.5,35.84 U$1.P$18 73.5,47.4 70.42,50.48 U$1.P$2 | v44.83,60.96 44.52,60.64 C17.1 44.52,52.07 | 44.52,52.07 44.52,47.8 | 44.52,47.8 C19.1 | U4.3 44.52,52.07 | U3.3 44.64,44.77 44.45,44.96 44.52,45.02 44.52,47.8 | LED2.1-VDD 132.46,65.51 C15.1 | v10.03,54.74 LED12.1-VDD | v20.83,61.34 20.83,63.85
  other vias: 130.08,53.35 45.08,74.03 57.68,77.12 70.57,78.43 83.57,78.34 96.14,77.07 108.95,74.14 120.57,70.4 132.46,65.39 144.02,57.9 127.13,35.72 136.92,44.02
+15V  (via drill 0.35, 0.5)
  Top 1.016: v66.29,58.29 65.5,57.5 U$1.P$1 | v96.01,58.29 v96.01,41.78
  Bottom 0.61: LED15.A 129.67,37.34 112.78,37.34 111.89,38.23 107.95,38.23 107.95,41.78 107.06,42.67
  Bottom 1.016: U2.2 106.95,49.93 106.3,49.28 | 106.3,49.28 105.83,48.81 R6.2 105.37,46.9 C8.1 C9.1 106.41,43.8 106.55,43.94 106.55,44.07 | 106.55,44.07 106.55,49.02 106.3,49.28 | 106.55,44.07 107.06,43.56 107.06,42.67 106.17,41.78 v96.01,41.78 | v66.29,58.29 v96.01,58.29
AMS  (via drill 0.35)
  Top 0.305: v82.42,15.24 82.04,15.62 82.04,30.73 82.36,31.05 Q1.G
  Bottom 0.305: v82.42,15.24 82.8,14.86 93.73,14.86 93.73,13.64 U$2.5
  other vias: 82.36,37.28
AMS_OUT
  Bottom 0.305: Q1.D 81.41,42.35 81.5,42.44 U$1.P$20
BOOT_5V
  Bottom 0.813: U2.1 112.61,47.79 113.28,47.12 114.82,47.12 C18.1
BSPD  (via drill 0.35)
  Top 0.305: U$2.7 89.55,14.54 89.55,36.35 Q3.G
  other vias: 90.48,37.28
BSPD_OUT
  Bottom 0.305: Q3.D 89.53,42.41 89.5,42.44 U$1.P$22
CARCAN_N
  Bottom 0.152: U3.6 56.23,44.77 R4.2 58.91,45.13 59.56,44.47 67.56,44.47 67.56,46.42 U$1.P$9
CARCAN_P
  Bottom 0.152: U3.7 56.32,43.5 R4.1 58.62,43.23 59.56,44.17 67.18,44.17 67.56,44.17 71.48,44.17 71.63,44.32 71.63,46.36 U$1.P$10
CARCAN_RX  (via drill 0.33, 0.35)
  Top 0.305: v96.14,24.76 U$2.4/CANRX | v29.84,45.34 29.84,41.53 v29.72,41.4 | v47.62,24.76 47.62,45.53 v48.13,46.04 v42.99,46.04
  Bottom 0.305: v47.62,24.76 v96.14,24.76 | U3.4 v48.13,46.04 | v42.99,46.04 42.54,45.59 30.1,45.59 v29.84,45.34 | v29.72,41.4 JP6.1
CARCAN_TX  (via drill 0.33, 0.35)
  Top 0.305: v49.28,27.43 48.64,28.07 48.64,41.96 U3.1 | v97.41,27.3 97.41,19.43 98.68,18.16 U$2.3/CANTX | v30.86,38.86 30.86,42.04 30.99,42.16 42.93,42.16 v43.05,42.04
  Bottom 0.305: v49.28,27.43 97.28,27.43 v97.41,27.3 | JP6.2 v30.86,38.86 | U3.1 43.25,42.23 v43.05,42.04
  other vias: 48.37,42.23
CLK  (via drill 0.35)
  Top 0.305: v75.82,14.86 75.82,28.73 U$2.13/SCK
  Bottom 0.305: H2.5 82.92,9.62 82.4,10.14 82.4,13.86 81.41,14.86 v75.82,14.86
COMP_5V
  Bottom 0.813: C12.1 122.81,50.68 R10.2 122.29,51.2 U2.6
CS  (via drill 0.35)
  Top 0.305: v78.49,10.79 v80.64,10.79
  Bottom 0.305: H2.2 78.42,10.73 v78.49,10.79 | v80.64,10.79 80.64,13.25 U$2.10/CS
D/C  (via drill 0.35)
  Top 0.305: v76.96,9.91 83.44,9.91 v83.57,10.03
  Bottom 0.305: H2.1 76.92,9.74 v76.96,9.91 | U$2.9/CS 83.57,13.37 v83.57,10.03
DAQCAN_N
  Bottom 0.152: U$1.P$7 89.5,52.48 88.75,53.24 64.83,53.24 63.06,51.46 59.94,51.46 59.15,52.26 R16.2 56.45,52.07 U4.6
DAQCAN_P
  Bottom 0.152: U4.7 56.2,50.8 R16.1 59.15,50.36 59.94,51.16 63.18,51.16 64.96,52.93 85.6,52.93 85.6,50.54 85.56,50.54 U$1.P$6
DAQCAN_RX  (via drill 0.33)
  Top 0.305: U$2.34/A15 52.95,29.22 51.31,30.86 51.31,53.21 49.53,53.21 v49.4,53.34 | v46.1,53.34 37.72,53.34 v37.72,49.78
  Bottom 0.305: JP9.2 v37.72,49.78 | v46.1,53.34 U4.4 v49.4,53.34
DAQCAN_TX  (via drill 0.33)
  Top 0.305: v50.42,49.53 50.41,49.52 U$2.33/A14 | v37.72,47.24 46.23,47.24 46.35,47.37 v46.35,49.53
  Bottom 0.305: JP9.1 v37.72,47.24 | v50.42,49.53 U4.1 v46.35,49.53
DI  (via drill 0.35)
  Top 0.305: v121.03,35.05 v121.03,14.73
  Bottom 0.305: U1.2 120.62,35.46 v121.03,35.05 | v121.03,14.73 101.22,14.73 U$2.2
DI2_MORE  (via drill 0.35)
  Top 0.305: v108.97,34.92 108.97,60.71 v108.71,60.96 | JP5.2 116.46,33.78 115.44,34.8 115.42,34.78 v114.05,34.78
  Bottom 0.305: v108.97,34.92 109.08,34.81 U1.12 111.39,34.78 v114.05,34.78 | v108.71,60.96 R11.2
DI2_OUT  (via drill 0.35)
  Top 0.305: v77.47,60.58 77.47,50.47 77.49,50.47 U$1.P$4
  Bottom 0.305: R11.1 77.85,60.96 v77.47,60.58
DI_MORE  (via drill 0.35)
  Top 0.305: v119.89,30.99 119.89,34.67 v119.76,34.8 | U$2.21/A7 96.13,32 v96.27,32.13
  Bottom 0.305: v119.89,30.99 109.85,30.99 108.71,32.13 v96.27,32.13 | v119.76,34.8 119.75,34.81 U1.3
DOWN  (via drill 0.35)
  Top 0.305: v68.2,19.81 U$2.25 | v42.54,36.83 42.54,35.51 42.5,35.46 42.5,22.78 v44.07,21.21
  Bottom 0.305: v44.07,21.21 45.47,19.81 v68.2,19.81 | H1.3 42.49,36.89 v42.54,36.83
DRS_FLAP  (via drill 0.35)
  Top 0.305: v60.58,16.13 U$2.28 | v41.15,41.4 41.15,38.69 41.1,38.64 41.1,20.75 v45.34,16.51
  Bottom 0.305: v45.34,16.51 45.72,16.13 v60.58,16.13 | v41.15,41.4 41.13,41.39 H1.6
FB_5V
  Bottom 0.813: U2.5 118.62,53.85 | 118.62,53.85 118.69,53.92 R28.1 | R29.2 118.17,54.3 118.62,53.85
GND  (via drill 0.33, 0.35)
  Top 0.305: U4.8 58.67,49.53 58.8,49.4 v58.8,49.53 | U4.2 48.45,47.56 v48.39,47.5
  Bottom 0.152: LED12.3-GND 15.75,61.98 15.75,66.04 18.01,68.31 18.05,68.33 LED11.3-GND 29.59,73.23 29.59,73.44 30.41,74.26 34.25,74.26 34.93,73.58 LED10.3-GND 42.72,77.99 45.87,77.99 46.55,77.31 LED9.3-GND 53.71,81.1 58.52,81.1 59.2,80.42 LED8.3-GND 64.57,82.41 71.41,82.41 72.09,81.73 LED7.3-GND 79.29,81.73 79.84,82.28 87.89,82.28 LED6.3-GND 100.02,81.61 LED5.3-GND 110.87,80.42 LED4.3-GND 121.74,77.44 LED3.3-GND 131.19,73.7 132.49,72.99 LED2.3-GND 142.56,67.44 142.85,67.28 LED1.3-GND
  Bottom 0.305: U1.7 115.23,32.21 v115.19,32.26 | U4.2 48.51,50.8 | v58.8,49.53 58.8,48.12 C20.2 | v48.39,47.5 46.62,47.5 C19.2
  Bottom 0.61: D6.3 D6.1
  Bottom 0.813: R29.1 115.61,54.28 U2.PAD1 116.25,49.93 U2.7
  other vias: 115.51,44.37 53.65,49.53 48.45,50.8
  pour Top (rank 6, no thermals): -5.72,90.17 164.59,90.3 165.1,-5.59 -5.21,-5.71
  pour Bottom (rank 6, no thermals): -3.05,87.76 161.42,87.88 162.05,-3.68 -2.41,-3.81
IGNITION_1  (via drill 0.33, 0.35)
  Top 0.305: v75.18,32.39 75.5,32.7 U$1.P$11 | R3.2 37.02,25.85 v37.08,25.78 | v55.49,32.25 v55.5,32.26 U$2.35/A16 v55.49,25.54 v55.5,25.53
  Bottom 0.305: v37.08,25.78 37.44,25.42 55.39,25.42 v55.5,25.53 | v75.18,32.39 75.06,32.26 v55.5,32.26
IGNITION_2  (via drill 0.33, 0.35)
  Top 0.305: v78.99,33.15 79.5,33.66 U$1.P$12 | R5.2 38.48,30.99 38.73,30.73 38.73,26.54 v38.86,26.42 | v58.04,26.42 v58.03,26.42 U$2.36/A17 v58.04,33.02
  Bottom 0.152: U$2.20/A6
  Bottom 0.305: v58.04,33.02 58.17,33.15 v78.99,33.15 93.6,33.15 U$2.20/A6 | v58.04,26.42 v38.86,26.42
IMD  (via drill 0.35)
  Top 0.305: Q2.G 86.29,31.68 84.71,30.1 v84.71,11.18 | U$2.6 91.05,11.18 v91.06,11.18
  Bottom 0.305: v91.06,11.18 v84.71,11.18
  other vias: 86.29,37.28
IMD_OUT
  Bottom 0.305: Q2.D 85.34,42.28 85.5,42.44 U$1.P$21
LEFT  (via drill 0.35)
  Top 0.305: v65.66,17.27 U$2.26 | v45.59,18.41 41.78,22.22 v41.78,38.35
  Bottom 0.305: v45.59,18.41 46.74,17.27 v65.66,17.27 | v41.78,38.35 41.75,38.39 H1.4
MISO  (via drill 0.33, 0.35)
  Top 0.305: v81.41,12.19 75.82,12.19 75.81,12.2 U$2.12/MISO | JP8.1 99.19,2.79 v81.41,2.79
  Bottom 0.305: v81.41,12.19 81.42,12.18 H2.4 81.41,8.12 v81.41,2.79
MOSI  (via drill 0.33)
  Top 0.305: JP8.2 103.12,2.92 101.6,1.4 80.01,1.4 v79.88,1.52
  Bottom 0.305: U$2.11/MOSI 78.23,13.38 78.23,11.68 79.88,11.68 79.92,11.65 H2.3 79.92,1.56 v79.88,1.52
N$2
  Bottom 0.305: LED1.2-DOUT 142.16,61.16 140.97,62.36 | R12.2 138.05,59.44 140.97,62.36 | LED2.4-DIN 139.08,62.36 140.97,62.36
N$3  (via drill 0.35)
  Top 0.305: v57.78,1.02 37.72,1.02 v37.59,1.14
  Bottom 0.305: H3.1 57.87,1.1 v57.78,1.02 | v37.59,1.14 JP1.1
N$4
  Bottom 0.305: LED3.4-DIN 131.61,70.41 LED2.2-DOUT
N$5
  Bottom 0.305: LED3.2-DOUT 118.32,73.7 117.63,74.39 114.11,74.39 LED4.4-DIN
N$6
  Bottom 0.305: LED4.2-DOUT 106.14,77.44 105.44,76.74 101.58,76.74 LED5.4-DIN
N$7
  Bottom 0.305: LED5.2-DOUT 94.14,80.42 92.02,78.31 LED6.4-DIN
N$8
  Bottom 0.305: LED7.4-DIN 76.45,78.43 77.29,78.43 78.03,78.43 78.1,78.36 79.38,79.63 79.38,81.28 79.7,81.61 LED6.2-DOUT
N$11  (via drill 0.35)
  Top 0.305: R9.1 111.38,57.53 v111.51,57.78
  Bottom 0.305: LED1.4-DIN 149.1,57.73 149.1,54.99 148.72,54.61 142.37,54.61 142.37,57.15 141.73,57.78 114.05,57.78 | v111.51,57.78 114.05,57.78 | R12.1 114.11,57.85 114.05,57.78
N$13  (via drill 0.35)
  Top 0.305: v59.18,1.9 40,1.9 v39.88,2.03
  Bottom 0.305: H3.2 59.37,2.09 v59.18,1.9 | v39.88,2.03 39.62,2.29 39.62,7.11 JP1.2
N$15  (via drill 0.35)
  Top 0.305: v60.71,2.67 41.02,2.67 v40.77,2.92 | v40.64,9.53 40.51,9.65 JP1.3
  Bottom 0.305: H3.3 60.87,2.83 v60.71,2.67 | v40.77,2.92 40.77,9.4 v40.64,9.53
N$16  (via drill 0.35)
  Top 0.305: v62.23,3.43 41.91,3.43 v41.66,3.68 | v41.66,12.19 JP1.4
  Bottom 0.305: H3.4 62.37,3.57 v62.23,3.43 | v41.66,3.68 v41.66,12.19
N$17  (via drill 0.35)
  Top 0.305: v63.88,4.06 62.52,4.06 62.5,4.09 43.03,4.09 v42.67,4.45 | v42.16,13.21 39.62,13.21 38.1,14.73 JP1.5
  Bottom 0.305: H3.5 63.87,4.08 v63.88,4.06 | v42.67,4.45 42.67,12.7 v42.16,13.21
N$18  (via drill 0.35)
  Top 0.305: v65.28,4.83 43.94,4.83 v43.69,5.08 | v42.42,14.22 40,14.22 39.62,14.61 39.62,16.89 39.24,17.27 JP1.6
  Bottom 0.305: H3.6 65.37,4.92 v65.28,4.83 | v43.69,5.08 43.69,12.95 v42.42,14.22
N$19  (via drill 0.35)
  Top 0.305: v66.67,5.46 65.57,5.46 65.55,5.48 45.06,5.48 v44.7,5.84 | v42.54,15.37 40.51,15.37 40.51,16.89 JP1.7
  Bottom 0.305: H3.7 66.87,5.65 v66.67,5.46 | v44.7,5.84 44.7,13.21 v42.54,15.37
N$20
  Bottom 0.813: LED14.C R14.2
N$21  (via drill 0.35)
  Top 0.305: v109.73,35.69 109.73,40 109.92,40.2 R9.2 | JP5.1 119,35.31 118.87,35.43 v113.16,35.43
  Bottom 0.305: v109.73,35.69 109.95,35.46 U1.13 113.13,35.46 v113.16,35.43
N$22
  Bottom 0.813: LED15.C R15.2
N$26  (via drill 0.35)
  Top 0.305: v68.2,6.1 66.97,6.1 66.95,6.12 46.08,6.12 v45.72,6.48 | v43.43,16.38 43.31,16.51 41.4,16.51 41.4,18.54 JP1.8
  Bottom 0.305: H3.8 68.37,6.27 v68.2,6.1 | v45.72,6.48 45.72,14.1 v43.43,16.38
N$27  (via drill 0.35)
  Top 0.305: v84.45,4.32 JP2.1
  Bottom 0.305: v84.45,4.32 84.45,8.09 H2.6
N$29
  Bottom 0.813: R10.1 124.93,49.1 C10.1
N$34
  Bottom 0.305: R2.2 35.78,51.66 J1.1
N$35
  Bottom 0.305: R1.2 35.44,53.81 J1.2
N$36
  Bottom 0.305: LED8.4-DIN 64.3,77.12 66.42,79.25 66.42,81.03 67.13,81.73 LED7.2-DOUT
N$37
  Bottom 0.305: LED9.4-DIN 53.44,74.01 53.85,74.42 53.85,80.01 54.26,80.42 LED8.2-DOUT
N$38
  Bottom 0.305: LED9.2-DOUT 43.02,77.31 42.04,76.33 42.04,71.12 41.19,70.28 LED10.4-DIN
N$39
  Bottom 0.305: LED10.2-DOUT 30.27,73.58 29.97,73.28 29.97,66.93 28.18,65.14 LED11.4-DIN
N$40
  Bottom 0.305: LED12.4-DIN 18.67,61.6 18.67,65.78 LED11.2-DOUT
N$56
  Bottom 0.813: LED13.C R13.2
PADDLE  (via drill 0.35)
  Top 0.305: U$2.32/A13 50.41,23.38 v50.29,23.5 | v44.7,24.13 44.7,42.04 v43.81,42.93
  Bottom 0.305: v50.29,23.5 49.91,23.88 44.7,23.88 v44.7,24.13 | v43.81,42.93 43.78,42.89 H1.7
RIGHT  (via drill 0.35)
  Top 0.305: v46.99,15.11 46.48,15.62 46.48,39.24 v46.35,39.37
  Bottom 0.305: v46.99,15.11 47.24,14.86 62.99,14.86 63.11,14.74 U$2.27 | H1.5 45.84,39.89 v46.35,39.37
RJ45_L1  (via drill 0.35)
  Top 0.305: v65.66,30.35 U$2.39/A20 | v27.94,53.59 27.94,29.34 v28.57,28.7
  Bottom 0.305: R1.1 30.54,53.59 v27.94,53.59 | v28.57,28.7 29.34,27.94 47.24,27.94 49.66,30.35 v65.66,30.35
RJ45_L2  (via drill 0.35)
  Top 0.305: v63.37,31.5 63.37,29 U$2.38/A19 | v29.59,29.59 28.96,30.23 v28.96,51.44
  Bottom 0.305: v63.37,31.5 53.29,31.5 53.24,31.45 49.23,31.45 47.37,29.59 v29.59,29.59 | R2.1 29.18,51.66 v28.96,51.44
RT_5V
  Bottom 0.813: R8.2 109.03,52.47 U2.4
SERVO_PWM  (via drill 0.35)
  Top 0.305: v71.63,33.91 71.5,34.04 71.5,43.31 73.5,45.31 U$1.P$3 | v98.55,33.78 98.67,33.66 U$2.22/A8
  Bottom 0.305: v71.63,33.91 98.42,33.91 v98.55,33.78 | JP7.1 113.79,27.56 98.55,27.56 98.55,28.62 U$2.22/A8
SW_5V
  pour Bottom: 118.87,49.15 117.35,47.62 116.33,47.62 116.33,45.85 116.59,45.59 118.11,45.59 118.11,38.73 118.62,38.23 129.67,38.23 132.08,40.64 132.08,45.97 130.18,47.88 120.27,47.88 119.89,48.26 119.89,49.15
SW_BIT0  (via drill 0.35)
  Top 0.305: R17.1 76.71,27.1 U$2.14/A0
  Bottom 0.305: R17.1 R18.2
  other vias: 76.71,21.22
SW_BIT0_IN  (via drill 0.35)
  Top 0.305: v69.47,23.37 69.47,42.29 69.47,42.41 69.47,42.45 U$1.P$17
  Bottom 0.305: R17.2 69.61,23.22 v69.47,23.37
SW_BIT1  (via drill 0.35)
  Top 0.305: U$2.15/A1 80.89,21.85 R19.1
  Bottom 0.305: R19.1 R20.2
  other vias: 80.39,21.35
SW_BIT1_IN  (via drill 0.35)
  Top 0.305: v79.5,31.37 79.5,23.5 v79.63,23.37 | U$1.P$13 83.5,31.81 v83.44,31.75
  Bottom 0.305: v83.44,31.75 83.06,31.37 v79.5,31.37 | v79.63,23.37 79.64,23.35 R19.2
SW_BIT2  (via drill 0.35)
  Top 0.305: U$2.16/A2 83.43,21.36 R21.1
  Bottom 0.305: R21.1 R22.2
  other vias: 83.57,21.22
SW_BIT2_IN  (via drill 0.35)
  Top 0.305: v85.37,23.24 v85.37,26.16 | v87.63,26.16 87.25,26.54 87.25,30.1 87.5,30.35 U$1.P$14
  Bottom 0.305: R21.2 85.35,23.22 v85.37,23.24 | v85.37,26.16 v87.63,26.16
SW_BIT3  (via drill 0.35)
  Top 0.305: U$2.17/A3 85.97,26.8 87.12,25.65 R23.1
  Bottom 0.305: R23.1 R24.2
  other vias: 87.12,21.35
SW_BIT3_IN  (via drill 0.35)
  Top 0.305: v92.46,23.5 92.46,39.62 91.44,40.64 91.44,46.38 91.5,46.44 U$1.P$15
  Bottom 0.305: R23.2 92.31,23.35 v92.46,23.5
SW_GS  (via drill 0.33)
  Top 0.305: v60.71,52.45 60.71,28.88 U$2.37/A18 | v93.22,54.48 93.5,54.2 U$1.P$8
  Bottom 0.305: v93.22,54.48 62.74,54.48 v60.71,52.45
TPS  (via drill 0.35)
  Top 0.305: U$2.8 v85.97,10.17 v85.98,10.16 | v92.46,10.16 92.46,14.48 93.73,15.75 93.73,17.53 94.87,18.67 94.87,29.97 94.55,30.29 Q4.G
  Bottom 0.305: v85.98,10.16 v92.46,10.16
  other vias: 94.55,37.15
TPS_OUT
  Bottom 0.305: Q4.D 93.6,42.34 93.5,42.44 U$1.P$23
UP  (via drill 0.35)
  Top 0.305: v70.61,22.48 70.73,22.36 U$2.24 | v43.18,35.18 v43.18,23.62
  Bottom 0.305: v43.18,23.62 44.32,22.48 v70.61,22.48 | H1.2 42.97,35.39 v43.18,35.18

### Text on the board
bNames: DAQCAN_RX | DAQCAN_TX | GND | CARCAN_RX | CARCAN_TX | 3v3 | 5v | VCC | PWM | DI2 | DI | MOSI | MISO | GND | Free Pins | Free Pin